# EAGLE design rev03 (EAGLE 6.5.0)
CrypTech avalanche noise evaluation board Revision 02 (c) NORDUnet A/S
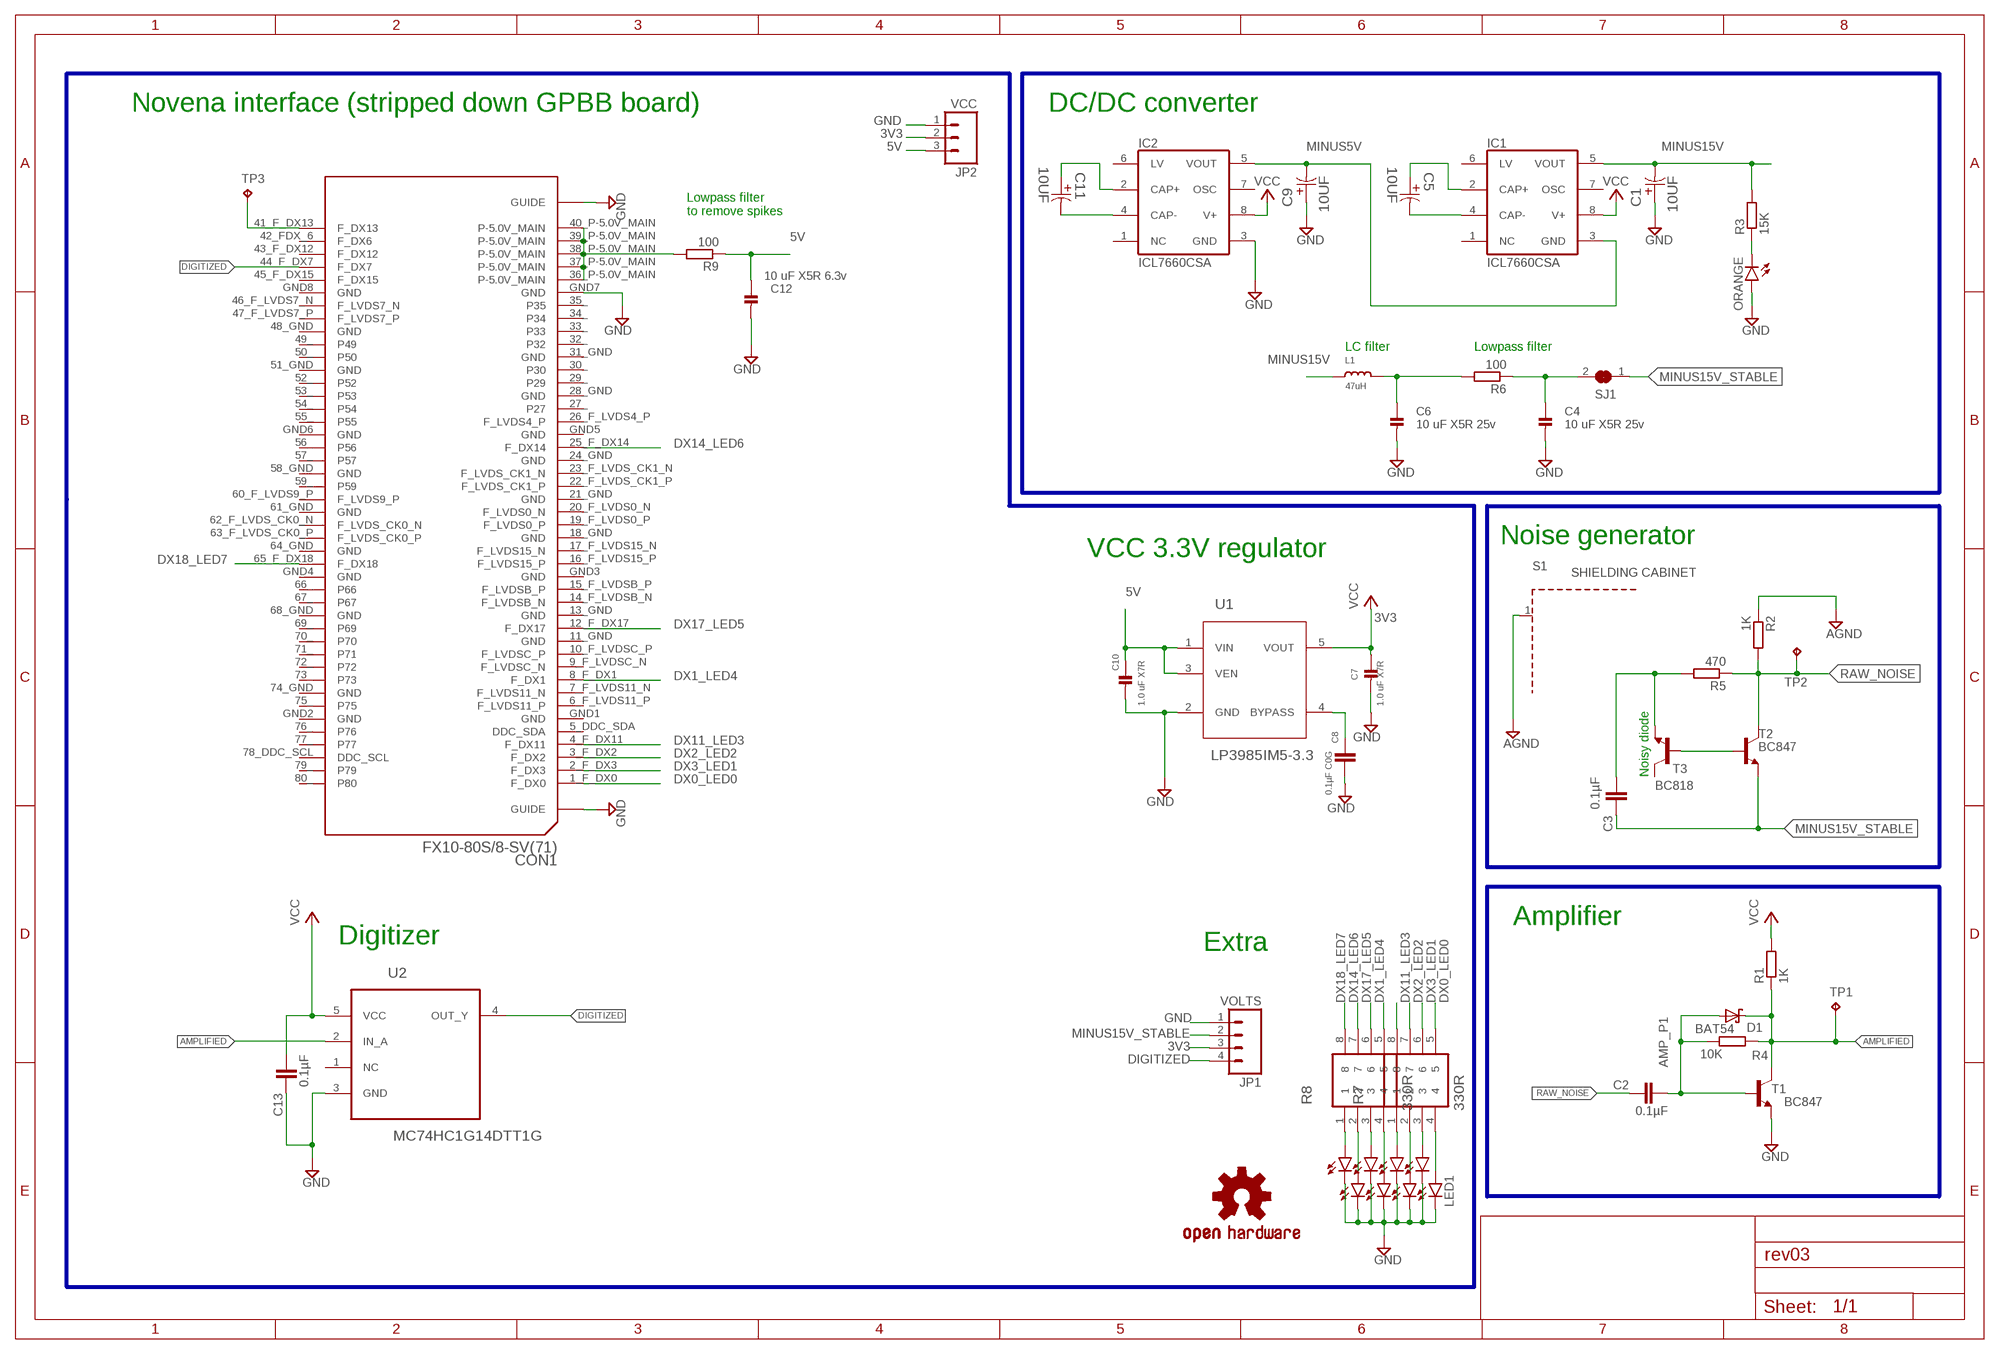
[diagram p0: schematic, sheet 1]

## Parts
C1  10UF  EEE-HA1E100R-CASE-C  [CAPAE530X610N]
C2  0.1µF  C-EUC0603  [C0603]
C3  0.1µF  C-EUC0603  [C0603]
C4  10 uF X5R 25v  CAP_CERAMIC_0805  [_0805]
C5  10UF  EEE-HA1E100R-CASE-C  [CAPAE530X610N]
C6  10 uF X5R 25v  CAP_CERAMIC_0805  [_0805]
C7  1.0 uF X7R  CAP_CERAMIC0805  [0805]
C8  0.1µF C0G  C-EUC0603  [C0603]
C9  10UF  EEE-HA1E100R-CASE-C  [CAPAE530X610N]
C10  1.0 uF X7R  CAP_CERAMIC0805  [0805]
C11  10UF  EEE-HA1E100R-CASE-C  [CAPAE530X610N]
C12  10 uF X5R 6.3v  CAP_CERAMIC0805  [0805]
C13  0.1µF  C-EUC0603  [C0603]
CON1  FX10-80S/8-SV(71)  [FX10A-80P/8-SV(71)]
D1  BAT54  [SOT23]
IC1  ICL7660CSA  [SO08]
IC2  ICL7660CSA  [SO08]
JP1  VOLTS  M04LOCK  [1X04_LOCK]
JP2  VCC  M03LOCK  [1X03_LOCK]
L1  47uH  INDUCTOR_0805  [_0805]
LED1  LED0603  [LED-0603]
LED2  LED0603  [LED-0603]
LED3  LED0603  [LED-0603]
LED4  LED0603  [LED-0603]
LED5  LED0603  [LED-0603]
LED6  LED0603  [LED-0603]
LED7  LED0603  [LED-0603]
LED8  LED0603  [LED-0603]
LOGO1  OSHW-LOGOL  [OSHW-LOGO-L]
ORANGE  LED0603  [LED-0603]
R1  1K  R-EU_R0603  [R0603]
R2  1K  R-EU_R0603  [R0603]
R3  15K  R-EU_R0603  [R0603]
R4  10K  R-EU_R0603  [R0603]
R5  470  R-EU_R0603  [R0603]
R6  100  R-EU_R0603  [R0603]
R7  330R  EXB38V331JV  [RESCAXE80P320X160X60-8N]
R8  330R  EXB38V331JV  [RESCAXE80P320X160X60-8N]
R9  100  R-EU_R0603  [R0603]
S1  SHIELDING CABINET  WE-SHC_36103205  [WE-SHC_36103205]
SJ1  SOLDERJUMPER_CLOSED  [SOLDERJUMPER_CLOSEDWIRE]
T1  BC847  [SOT23]
T2  BC847  [SOT23]
T3  BC818  BC818-40SMD  [SOT23-BEC]
TP1  TPB1,27  [B1,27]
TP2  TPB1,27  [B1,27]
TP3  TP_NEAT  [TP_NEAT_0032]
U1  LP3985IM5-3.3  [SOT95P300X120-5N]
U2  MC74HC1G14DTT1G  [SOT95P275X110-5N]

## Nets
3V3: C7.1 C13.2 JP1.3 JP2.2 R1.2 U1.5(VOUT) U2.5(VCC) ; supply symbol labelled VCC
5V: C10.1 C12.1 IC1.8(V+) IC2.8(V+) JP2.3 R9.1 U1.1(VIN) U1.3(VEN) ; supply symbol labelled VCC
AGND: C13.1 R2.1 S1.1(GND) T1.2(E) U2.3(GND) ; supply symbol labelled GND
AMP_P1: C2.2 D1.1(A) R4.1 T1.1(B)
AMPLIFIED: D1.3(C) R1.1 R4.2 T1.3(C) TP1.TP U2.2(IN_A)
DIGITIZED: CON1.44_F_DX7(F_DX7) JP1.4 U2.4(OUT_Y)
DX0_LED0: CON1.1_F_DX0(F_DX0) R7.5
DX1_LED4: CON1.8_F_DX1(F_DX1) R8.5
DX2_LED2: CON1.3_F_DX2(F_DX2) R7.7
DX3_LED1: CON1.2_F_DX3(F_DX3) R7.6
DX11_LED3: CON1.4_F_DX11(F_DX11) R7.8
DX13: CON1.41_F_DX13(F_DX13) TP3.TP
DX14_LED6: CON1.25_F_DX14(F_DX14) R8.7
DX17_LED5: CON1.12_F_DX17(F_DX17) R8.6
DX18_LED7: CON1.65_F_DX18(F_DX18) R8.8
GND [Ground]: C1.1 C4.2 C6.2 C7.2 C8.1 C9.1 C10.2 C12.2 CON1.GND7(GND) CON1.GUIDE@L(GUIDE) CON1.GUIDE@R(GUIDE) IC2.3(GND) JP1.1 JP2.1 LED1.C LED2.C LED3.C LED4.C LED5.C LED6.C LED7.C LED8.C ORANGE.A U1.2(GND)
MINUS5V: C9.2 IC1.3(GND) IC2.5(VOUT)
MINUS15V: C1.2 IC1.5(VOUT) L1.1 R3.2
MINUS15V_STABLE: C3.1 JP1.2 SJ1.1 T2.2(E)
N$1: C5.2 IC1.4(CAP-)
N$2: C11.2 IC2.4(CAP-)
N$3: C11.1 IC2.2(CAP+)
N$4: LED1.A R7.4
N$5: LED2.A R7.3
N$6: C4.1 R6.1 SJ1.2
N$7: ORANGE.C R3.1
N$8: C8.2 U1.4(BYPASS)
N$9: C5.1 IC1.2(CAP+)
N$11: C6.1 L1.2 R6.2
N$15: LED3.A R7.2
N$16: LED4.A R7.1
N$17: LED5.A R8.4
N$18: LED6.A R8.3
N$19: LED7.A R8.2
N$20: LED8.A R8.1
NOISE_IN: C3.2 R5.2 T3.E
NOISE_OUT: T2.1(B) T3.B
P-5.0V_MAIN: CON1.36_P-5.0V_MAIN(P-5.0V_MAIN) CON1.37_P-5.0V_MAIN(P-5.0V_MAIN) CON1.38_P-5.0V_MAIN(P-5.0V_MAIN) CON1.39_P-5.0V_MAIN(P-5.0V_MAIN) CON1.40_P-5.0V_MAIN(P-5.0V_MAIN) R9.2
RAW_NOISE: C2.1 R2.2 R5.1 T2.3(C) TP2.TP
Unconnected: CON1.5_DDC_SDA(DDC_SDA) CON1.6_F_LVDS11_P(F_LVDS11_P) CON1.7_F_LVDS11_N(F_LVDS11_N) CON1.9_F_LVDSC_N(F_LVDSC_N) CON1.10_F_LVDSC_P(F_LVDSC_P) CON1.11_GND(GND) CON1.13_GND(GND) CON1.14_F_LVDSB_N(F_LVDSB_N) CON1.15_F_LVDSB_P(F_LVDSB_P) CON1.16_F_LVDS15_P(F_LVDS15_P) CON1.17_F_LVDS15_N(F_LVDS15_N) CON1.18_GND(GND) CON1.19_F_LVDS0_P(F_LVDS0_P) CON1.20_F_LVDS0_N(F_LVDS0_N) CON1.21_GND(GND) CON1.22_F_LVDS_CK1_P(F_LVDS_CK1_P) CON1.23_F_LVDS_CK1_N(F_LVDS_CK1_N) CON1.24_GND(GND) CON1.26_F_LVDS4_P(F_LVDS4_P) CON1.27_(P27) CON1.28_GND(GND) CON1.29_(P29) CON1.30_(P30) CON1.31_GND(GND) CON1.32_(P32) CON1.33_(P33) CON1.34_(P34) CON1.35_(P35) CON1.42_FDX_6(F_DX6) CON1.43_F_DX12(F_DX12) CON1.45_F_DX15(F_DX15) CON1.46_F_LVDS7_N(F_LVDS7_N) CON1.47_F_LVDS7_P(F_LVDS7_P) CON1.48_GND(GND) CON1.49_(P49) CON1.50_(P50) CON1.51_GND(GND) CON1.52_(P52) CON1.53_(P53) CON1.54_(P54) CON1.55_(P55) CON1.56_(P56) CON1.57_(P57) CON1.58_GND(GND) CON1.59_(P59) CON1.60_F_LVDS9_P(F_LVDS9_P) CON1.61_GND(GND) CON1.62_F_LVDS_CK0_N(F_LVDS_CK0_N) CON1.63_F_LVDS_CK0_P(F_LVDS_CK0_P) CON1.64_GND(GND) CON1.66_(P66) CON1.67_(P67) CON1.68_GND(GND) CON1.69_(P69) CON1.70_(P70) CON1.71_(P71) CON1.72_(P72) CON1.73_(P73) CON1.74_GND(GND) CON1.75_(P75) CON1.76_(P76) CON1.77_(P77) CON1.78_DDC_SCL(DDC_SCL) CON1.79_(P79) CON1.80_(P80) IC1.1(NC) IC1.6(LV) IC1.7(OSC) IC2.1(NC) IC2.6(LV) IC2.7(OSC) T3.C U2.1(NC)

## Buses
B$1
B$2
B$3
B$4
B$5

## Notes on the sheet
- Novena interface (stripped down GPBB board) | DC/DC converter
- Lowpass filter
  to remove spikes
- LC filter | Lowpass filter
- Noise generator
- VCC 3.3V regulator
- Noisy diode
- Amplifier
- Digitizer | Extra

## Power pins joined to a net without a drawn wire
GND: CON1.GND1(GND) CON1.GND2(GND) CON1.GND3(GND) CON1.GND4(GND) CON1.GND5(GND) CON1.GND6(GND) CON1.GND8(GND)

## Library data of the parts
C1 C5 C9 C11 = Panasonic-EEEFT_EEEH:EEE-: Aluminum Electrolytic Capacitors,Surface Mount Type; MPN: EEE-HA1E100R; OC_FARNELL: 1973321; OC_NEWARK: 58T9232; PACKAGE: CASE-C; SUPPLIER: PANASONIC; TOLERANCE: ±20 %; VOLTAGERATING: 25V
C2 C3 C8 C13 = rcl:C-EU: CAPACITOR, European symbol
C4 C6 C7 C10 C12 = microbuilder:CAP_CERAMIC: Ceramic Capacitors 0402 - 0402 Surface Mount Capacitors 16pF 50V 5% [Digikey: 445-4899-2-ND] 18pF 50V 5% [Digikey: 490-1281-2-ND] 22pF 50V 5% [Digikey: 490-1283-2-ND] 68pF 50V 5% [Digikey: 490-1289-2-ND] 0.1uF 10V 10% [Digikey: 490-1318-2-ND] 1.0uF 6.3V 10% [Digikey: 490-1320-2-ND] 0603 - 0603 Surface Mount Capacitors 16 pF 50V 5% [Digikey: 445-5051-2-ND] 22 pF 50V [Digikey: PCC220ACVTR-ND] 33 pF 50V 5% [Digikey: 490-1415-1-ND] 56pF 50V 5% [Digikey: 490-1421-1-ND] 220pF 50V 5% [Digikey: 445-1285-1-ND] 680 pF 50V 2200 pF 50V 5% C0G [Digikey: 445-1297-1-ND] 5600 pF 100V 5% X7R [Digikey: 478-3711-1-ND] 0.1 µF 25V 10% [Digikey: PCC2277TR-ND] 0.22 µF 16V 10% X7R [Digikey: 445-1318-1-ND] 1.0 µF 25V 10% [Digikey: 445-5146-2-ND] 0603 - RF Specific 3pF 250V +/-0.1pF RF [Digikey: 712-1347-1-ND] 18 pF 250V 5% [Digikey: 478-3505-1-ND or 712-1322-1-ND] 56 pF 250V 5% C0G RF [Digikey: 490-4867-1-ND] 68 pF 250V RF [Digikey: 490-4868-1-ND] 0805 - 0805 Surface Mount Capacitors 220 pF 250V 2% RF Ceramic Capacitor [Digikey: 712-1398-1-ND] 1000 pF 50V 2% NP0 Ceramic Capacitor [Digikey: 478-3760-1-ND] 0.1 µF 25V 10% Ceramic Capacitor [Digikey: PCC1828TR-ND] 1.0 µF 16V 10% Ceramic Capacitor[Digikey: 490-1691-2-ND] 10.0 µF 10V 10% Ceramic Capacitor[Digikey: 709-1228-1-ND] 10.0 uF 16V 10% Ceramic Capacitor [Digikey: 478-5165-2-ND] 47 uF 6.3V 20% Ceramic Capacitor [Digikey: 587-1779-1-ND or 399-5506-1-ND] 1206 - 1206 Surface Mount Capacitors 47uF 10V 20% Ceramic Capacitor [Digikey: 490-5528-1-ND or 399-5508-1-ND or 445-6010-1-ND] 100uF 6.3V -20%, +80% Y5V Ceramic Capacitor (Digikey: 490-4512-1-ND, Mouser: 81-GRM31CF50J107ZE1L)
CON1 = Novena_FX10A-80S:FX10*-80S/8-SV(71): HRS FX10A-80S/8-SV(71) 10+ Gbps 0.5 mm pitch Stacking Connectors This is the connector used to connect the General Purpose Breakout Board (GPBB) to the Novena.
D1 = diode:BAT54: Schottky Diodes Source: Fairchild .. BAT54.pdf
IC1 IC2 = maxim:ICL7660CSA: VOLTAGE CONVERTER; MF: MAXIM; MPN: ICL7660CSA; OC_FARNELL: 9724710; OC_NEWARK: 34C3732
JP1 = SparkFun-Connectors:M04: Header 4 Standard 4-pin 0.1" header. Use with straight break away headers (SKU : PRT-00116), right angle break away headers (PRT-00553), swiss pins (PRT-00743), machine pins (PRT-00117), and female headers (PRT-00115). Molex polarized connector foot print use with SKU : PRT-08231 with associated crimp pins and housings. 1MM SMD Version SKU: PRT-10208
JP2 = SparkFun-Connectors:M03: Header 3 Standard 3-pin 0.1" header. Use with straight break away headers (SKU : PRT-00116), right angle break away headers (PRT-00553), swiss pins (PRT-00743), machine pins (PRT-00117), and female headers (PRT-00115). Molex polarized connector foot print use with SKU : PRT-08232 with associated crimp pins and housings.
L1 = microbuilder:INDUCTOR: Inductors 0603: 10nH Ceramic Inductor - microwire antenna/RF (Digikey: 712-1434-2-ND) 0805: 560nH Ceramic Inductor - RF (Digikey: 553-1047-1-ND) 270nH Ceramic Inductor - Q = 40@250MHz, +-5%, 1 Ohm DC Resistance (Digikey: 535-10506-2-ND) 1007 (2518 Metric) SMT: 10µH 10% 250mOhm 820mA 1007 Inductor (Digikey: 587-2189-1-ND) 22µH 10% 500mOhm 580mA 1007 Inductor (Digikey: 587-2190-1-ND) 47µH 10% 950mOhm 420mA 1007 Inductor (Digikey: 587-2191-1-ND) 47µH 5% 100mOhm 1A 1008 Inductor (Digikey: 732-1816-1-ND) 5.0x5.0mm (Taiyo Yuden NR5040 Series) 6.8µH 20% 2.3A 64mOhm Inductor (Digikey: 587-2374-2-ND) 5.0x5.0mm (TDK VLC5045 Series) 4.7µH 20% 3.3A 34mOhm Inductor (Digikey: 445-6526-1-ND) 6.8µH 20% 2.7A 46mOhm Inductor (Digikey: 445-6527-1-ND) 6.0x6.0mm (TDK VLC6045 Series) 4.7µH 20% 3.8A 27mOhm Inductor (Digikey: 445-6538-2-ND) 6.8µH 20% 3A 41mOhm Inductor (Digikey: 445-6540-1-ND) 6.2µH 30% 2.2A 45mOhm Inductor (Digikey: SRR5028-6R2YCT-ND) - Not TDK VLC6045 but footprint should match 6.0x6.0mm (TDK SLF6045 Series) 6.8uH 30% 2A 33mOhm Inductor (Digikey: 445-4572-1-ND, Mouser: 810-SLF645T6R8N2R0PF)
LED1-LED8 ORANGE = SparkFun-LED:LED: LEDs Standard schematic elements and footprints for 5mm, 3mm, 1206, and 0603 sized LEDs. 5mm - Spark Fun Electronics SKU : COM-00529 (and others)
LOGO1 = SparkFun-Aesthetics:OSHW-LOGO: Open Source Hardware Logo This logo indicates the piece of hardware it is found on incorporates a OSHW license and/or adheres to the definition of open source hardware found here: http://freedomdefined.org/OSHW
R1-R6 R9 = resistor:R-EU_: RESISTOR, European symbol
R7 R8 = Panasonic-EXB-ERJ:EXB38V: Chip Resistor Array; MPN: EXB38V331JV; OC_FARNELL: 2060095; OC_NEWARK: 65T9098; PACKAGE: 0603; POWERRATING: 0.063 W/element; SUPPLIER: PANASONIC; TOLERANCE: ±5 %
S1 = WE-SHC:WE-SHC: WE-SHC Shielding cabinet; MPN: 36103205; OC_FARNELL: 1909657; OC_NEWARK: 58T2480; PACKAGE: Frame_SMD; SUPPLIER: Wuerth Elektronik
SJ1 = microbuilder:SOLDERJUMPER_CLOSED: Solder Jumper - Closed These solder jumpers are closed by default CLOSEDWIRE - 10 mil trace between pads that can be cut and resoldered later CLOSEDPERM - 63 mil trace between pads for a permanent connection (used to 'bridge' two signals, a shameless hack for Eagle). Can double as a test point as well (no cream layer)
T1 T2 = transistor:BC847: NPN TRANSISTOR
T3 = transistor-npn:BC818*: NPN Transistor
TP1 TP2 = testpad:TP: Test pad
TP3 = BetterTestpads:TP_NEAT: Throughhole testpoint with neat footprint
U1 = LP3985IM5:LP3985IM5-3.3: Low-Dropout CMOS Voltage Regulator; MPN: LP3985IM5-3.3; OC_FARNELL: 1469025; OC_NEWARK: 23K8224; PACKAGE: SOT-5; SUPPLIER: NationalSemiconductor
U2 = MC74HC1G14DTT1G:MC74HC1G14DTT1G: Single Inverter with Schmitt-Trigger Input; MPN: MC74HC1G14DTT1G; OC_FARNELL: 1468757; OC_NEWARK: 71J5593; PACKAGE: SOT-23-5; SUPPLIER: ON SEMICONDUCTOR

## Net classes
1 Ground: width 0.203 mm, drill 0.61 mm

## Board
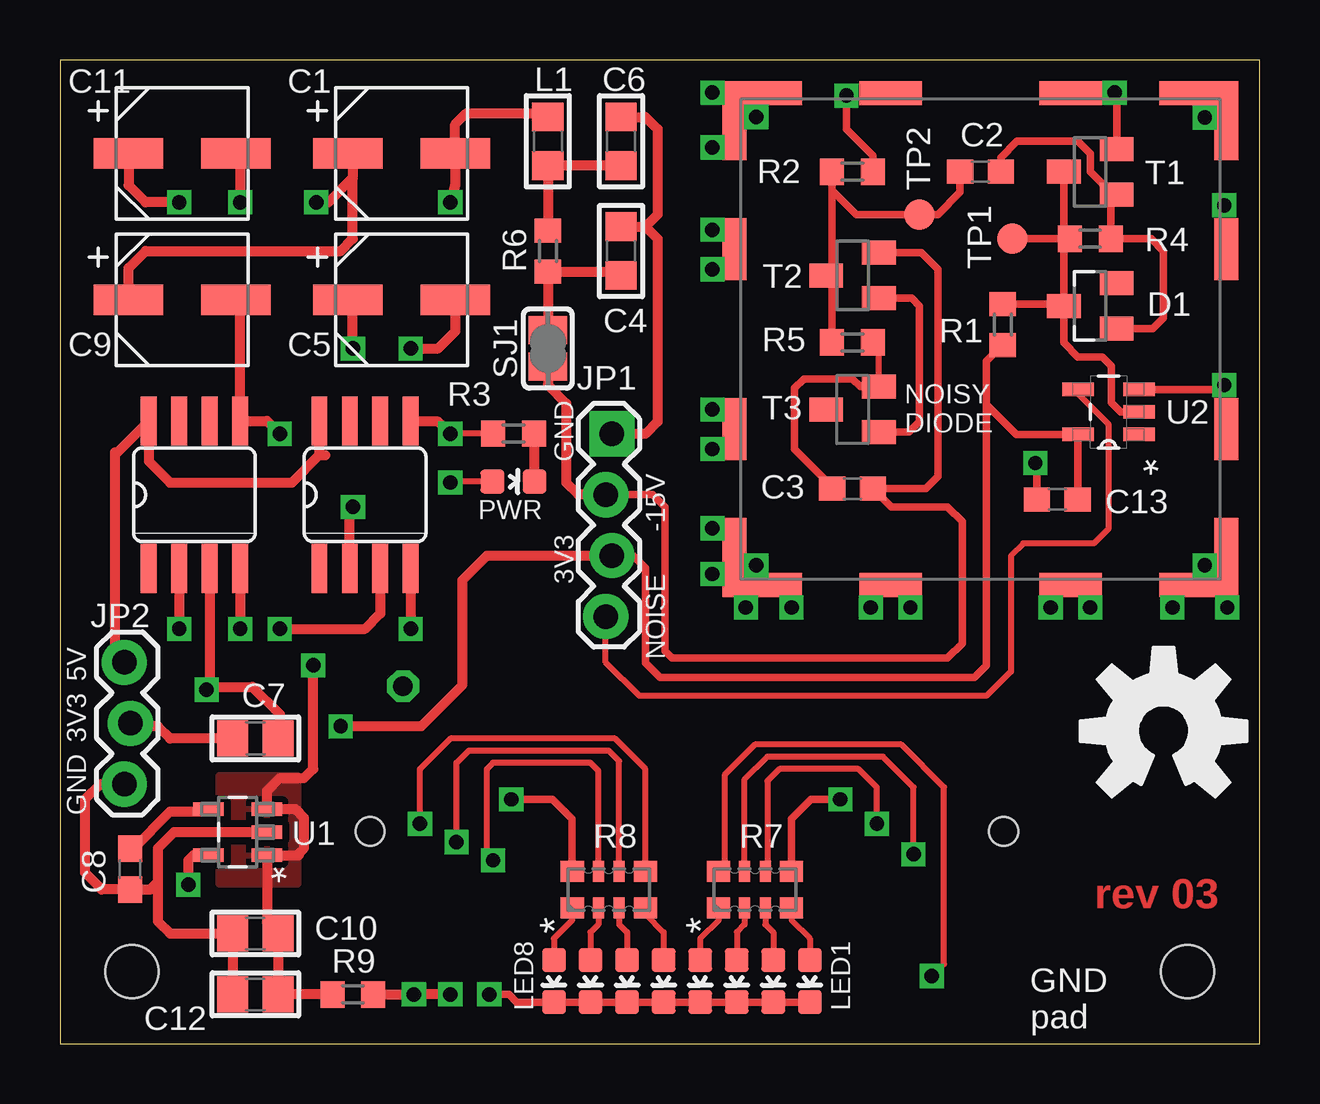
[diagram p1: board, top side]
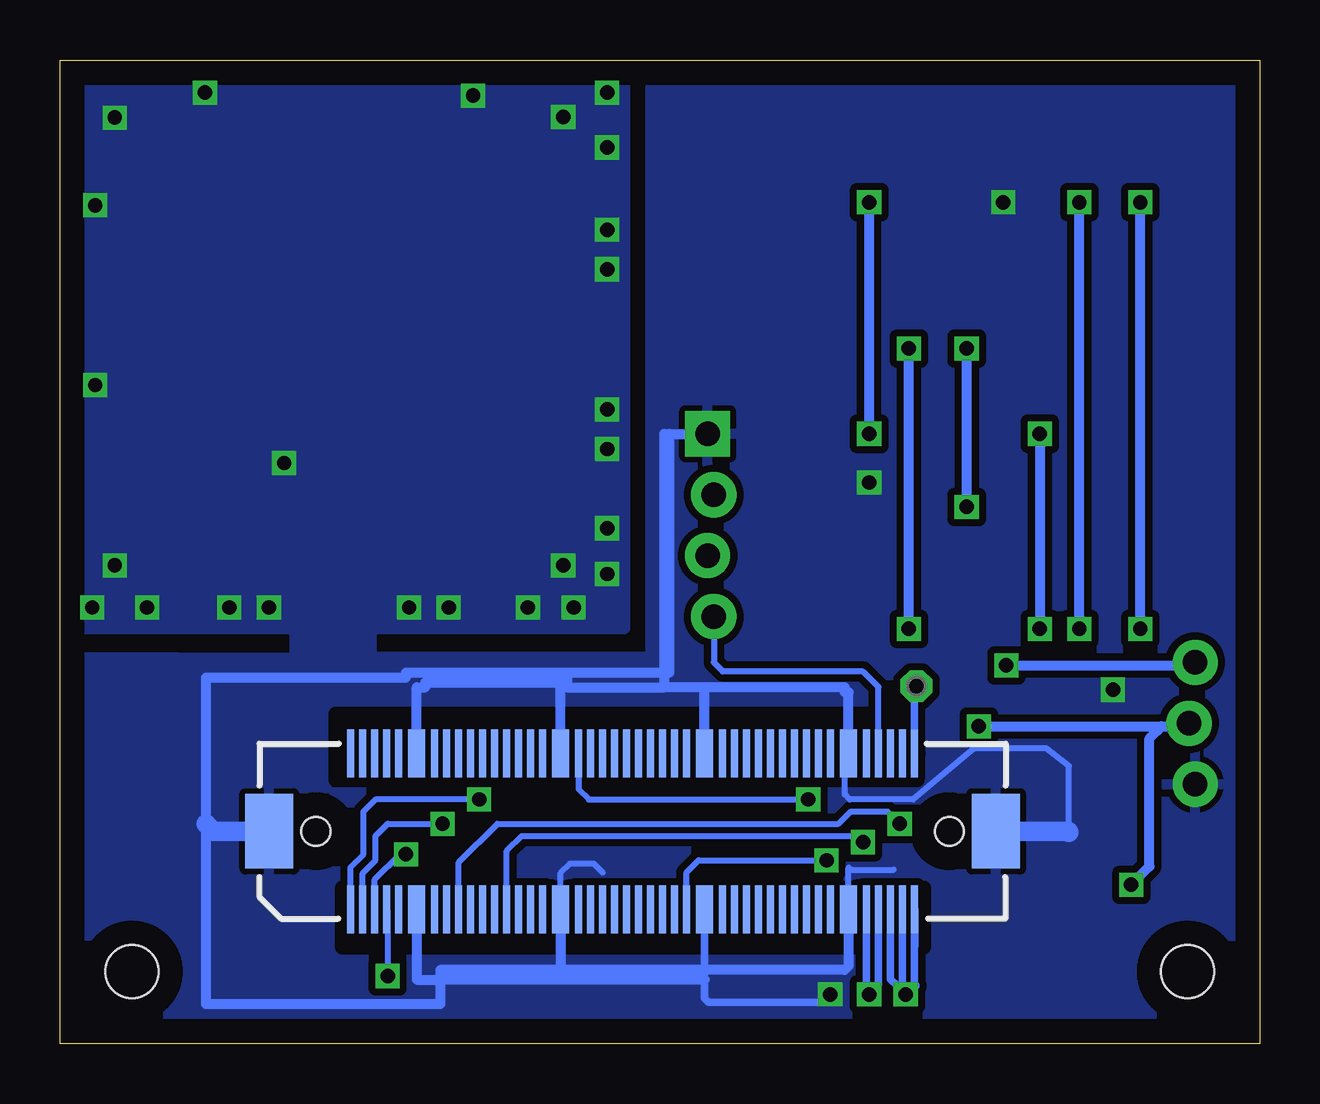
[diagram p2: board, bottom side, seen from below]

Size 50 x 41 mm. Coordinates in mm from the lower left corner, seen from the top.
Outline: 50,0 50,41 0,41 0,0 50,0
Copper layers (1*16): Top 0.035mm / dielectric 1.5mm / Bottom 0.035mm
Design rules "cogra": minimum track width 10mil, minimum drill 0.3mm, track to track 8mil, track to pad 8mil, pad to pad 8mil, via to via 8mil, smd to smd 8mil, copper to edge 40mil, drill to drill 8mil, minimum pad ring 10mil, minimum via ring 8mil, stop-mask expansion 4mil, vias tented up to drill 0mil, thermal gap 10mil
Holes 2.2 mm at 3,3 47,3
bRestrict: area 14.3,11 to 38.5,13.7; area 14,4 to 38.2,6.5

### Footprints (pad centres in the part's own frame; a part is rotated, then mirrored left to right if it is on the bottom)
CAPAE530X610N = smd 2.896 x 1.27: 1 -2.235,0; 2 2.235,0
C0603 = smd 1.1 x 1: 1 -0.85,0; 2 0.85,0
_0805 = smd 1.2 x 1.3: 1 -1.016,0; 2 1.016,0
0805 = smd 1.3 x 1.5: 1 -0.95,0; 2 0.95,0
FX10A-80P/8-SV(71) = smd 0.3 x 2 bottom: 1_F_DX0 11.48,-3.25; 2_F_DX3 10.98,-3.25; 3_F_DX2 10.48,-3.25; 4_F_DX11 9.98,-3.25; 5_DDC_SDA 9.48,-3.25; 6_F_LVDS11_P 7.98,-3.25; 7_F_LVDS11_N 7.48,-3.25; 8_F_DX1 6.98,-3.25; 9_F_LVDSC_N 6.48,-3.25; 10_F_LVDSC_P 5.98,-3.25; 11_GND 5.48,-3.25; 12_F_DX17 4.98,-3.25; 13_GND 4.48,-3.25; 14_F_LVDSB_N 3.98,-3.25; 15_F_LVDSB_P 3.48,-3.25; 16_F_LVDS15_P 1.98,-3.25; 17_F_LVDS15_N 1.48,-3.25; 18_GND 0.98,-3.25; 19_F_LVDS0_P 0.48,-3.25; 20_F_LVDS0_N -0.02,-3.25; 21_GND -0.52,-3.25; 22_F_LVDS_CK1_P -1.02,-3.25; 23_F_LVDS_CK1_N -1.52,-3.25; 24_GND -2.02,-3.25; 25_F_DX14 -2.52,-3.25; 26_F_LVDS4_P -4.02,-3.25; 27_ -4.52,-3.25; 28_GND -5.02,-3.25; 29_ -5.52,-3.25; 30_ -6.02,-3.25; 31_GND -6.52,-3.25; 32_ -7.02,-3.25; 33_ -7.52,-3.25; 34_ -8.02,-3.25; 35_ -8.52,-3.25; 36_P-5.0V_MAIN -10.02,-3.25; 37_P-5.0V_MAIN -10.52,-3.25; 38_P-5.0V_MAIN -11.02,-3.25; 39_P-5.0V_MAIN -11.52,-3.25; 40_P-5.0V_MAIN -12.02,-3.25; 41_F_DX13 -12.02,3.25; 42_FDX_6 -11.52,3.25; 43_F_DX12 -11.02,3.25; 44_F_DX7 -10.52,3.25; 45_F_DX15 -10.02,3.25; 46_F_LVDS7_N -8.52,3.25; 47_F_LVDS7_P -8.02,3.25; 48_GND -7.52,3.25; 49_ -7.02,3.25; 50_ -6.52,3.25; 51_GND -6.02,3.25; 52_ -5.52,3.25; 53_ -5.02,3.25; 54_ -4.52,3.25; 55_ -4.02,3.25; 56_ -2.52,3.25; 57_ -2.02,3.25; 58_GND -1.52,3.25; 59_ -1.02,3.25; 60_F_LVDS9_P -0.52,3.25; 61_GND -0.02,3.25; 62_F_LVDS_CK0_N 0.48,3.25; 63_F_LVDS_CK0_P 0.98,3.25; 64_GND 1.48,3.25; 65_F_DX18 1.98,3.25; 66_ 3.48,3.25; 67_ 3.98,3.25; 68_GND 4.48,3.25; 69_ 4.98,3.25; 70_ 5.48,3.25; 71_ 5.98,3.25; 72_ 6.48,3.25; 73_ 6.98,3.25; 74_GND 7.48,3.25; 75_ 7.98,3.25; 76_ 9.48,3.25; 77_ 9.98,3.25; 78_DDC_SCL 10.48,3.25; 79_ 10.98,3.25; 80_ 11.48,3.25 | smd 0.7 x 2 bottom: GND1 8.73,-3.25; GND2 2.73,-3.25; GND3 -3.27,-3.25; GND4 -9.27,-3.25; GND5 -9.27,3.25; GND6 -3.27,3.25; GND7 2.73,3.25; GND8 8.73,3.25 | smd 2 x 3.1 bottom: GUIDE@L 14.88,0; GUIDE@R -15.42,0 | hole 1.2: -13.47,0; 12.93,0
SOT23 = smd 1 x 1.4: 1 -0.95,-1.1; 2 0.95,-1.1; 3 0,1.1
SO08 = smd 0.66 x 2.032: 1 -1.905,-3.073; 2 -0.635,-3.073; 3 0.635,-3.073; 4 1.905,-3.073; 5 1.905,3.073; 6 0.635,3.073; 7 -0.635,3.073; 8 -1.905,3.073
1X04_LOCK = drill 1.016 pad 1.88 square: 1 0,0.127 | drill 1.016 pad 1.88: 2 2.54,-0.127; 3 5.08,0.127; 4 7.62,-0.127
1X03_LOCK = drill 1.016 pad 1.88: 1 0,0.127; 2 2.54,-0.127; 3 5.08,0.127
LED-0603 = smd 1 x 1: A 0,-0.877; C 0,0.877
R0603 = smd 1 x 1.1: 1 -0.85,0; 2 0.85,0
RESCAXE80P320X160X60-8N = smd 0.864 x 0.965: 1 -0.762,1.524; 4 -0.762,-1.524; 5 0.762,-1.524; 8 0.762,1.524 | smd 0.864 x 0.457: 2 -0.762,0.432; 3 -0.762,-0.432; 6 0.762,-0.432; 7 0.762,0.432
WE-SHC_36103205 = smd 3.3 x 1: 1 9.1,10.25; 6 9.1,-10.25; 9 -9.1,-10.25; 14 -9.1,10.25 | smd 1 x 3.3: 2 10.25,9.1; 5 10.25,-9.1; 10 -10.25,-9.1; 13 -10.25,9.1 | smd 1 x 2.6: 3 10.25,3.75; 4 10.25,-3.75; 11 -10.25,-3.75; 12 -10.25,3.75 | smd 2.6 x 1: 7 3.75,-10.25; 8 -3.75,-10.25; 15 -3.75,10.25; 16 3.75,10.25
SOLDERJUMPER_CLOSEDWIRE = smd 1.168 x 1.6: 1 -0.762,0; 2 0.762,0 | smd 0.61 x 0.305: WIRE 0,0
SOT23-BEC = smd 1 x 1.4: B -0.95,-1.1; C 0,1.1; E 0.95,-1.1
B1,27 = smd 1.27 x 1.27: TP 0,0
TP_NEAT_0032 = drill 0.813 octagon: TP -0.01,-0.001
SOT95P300X120-5N = smd 1.27 x 0.559: 1 -1.219,0.965; 2 -1.219,0; 3 -1.219,-0.965; 4 1.219,-0.965; 5 1.219,0.965
SOT95P275X110-5N = smd 1.321 x 0.559: 1 -1.27,0.94; 2 -1.27,0; 3 -1.27,-0.94; 4 1.27,-0.94; 5 1.27,0.94

### Placement (x,y rotation side)
C1  14.24,37.1 0 top
C2  38.37,36.34 0 top
C3  33.04,23.13 180 top
C4  23.38,33.04 90 top
C5  14.24,31 0 top
C6  23.38,37.61 90 top
C7  8.14,12.72 0 top
C8  2.92,7.27 90 top
C9  5.1,31 0 top
C10  8.14,4.59 180 top
C11  5.1,37.1 0 top
C12  8.14,2.05 180 top
C13  41.57,22.67 0 top
CON1  26.4,8.85 0 top
D1  42.94,30.75 90 top
IC1  12.72,22.88 0 top
IC2  5.6,22.88 0 top
JP1  22.88,25.42 270 top
JP2  2.81,10.81 90 top
L1  20.34,37.61 270 top
LED1  31.26,2.6 180 top
LED2  29.73,2.6 180 top
LED3  28.21,2.6 180 top
LED4  26.69,2.6 180 top
LED5  25.16,2.6 180 top
LED6  23.64,2.6 180 top
LED7  22.11,2.6 180 top
LED8  20.59,2.6 180 top
LOGO1  46,13.03 0 top
ORANGE  18.9,23.43 270 top
R1  39.3,29.97 270 top
R2  33.04,36.34 180 top
R3  18.9,25.43 180 top
R4  42.94,33.54 180 top
R5  33.04,29.23 0 top
R6  20.34,33.04 90 top
R7  28.97,6.41 90 top
R8  22.88,6.41 90 top
R9  12.21,2.05 0 top
S1  38.37,29.36 0 top
SJ1  20.34,28.97 90 top
T1  42.94,36.34 90 top
T2  33.04,32.02 90 top
T3  33.04,26.43 90 top
TP1  39.69,33.54 90 top
TP2  35.83,34.56 90 top
TP3  14.29,14.9 0 bottom
U1  7.41,8.81 180 top
U2  43.7,26.33 180 top

### Tracks (layer width: path | path; a pad name or v marks a point on that pad's centre or on a via)
3V3  (via drill 0.6)
  Top 0.305: JP1.3 23.89,20.34 24.4,19.83 24.4,15.87 25.01,15.26 38.12,15.26 38.62,15.76 38.62,26.64 | R1.2 38.62,28.45 38.62,26.64 | 38.62,26.64 39.87,25.39 U2.5 42.43,23.5 C13.2
  Top 0.406: U1.5 5.56,7.85 5.35,7.64 v5.35,6.62 | C7.1 4.59,12.72 4.08,13.22 3.06,13.22 JP2.2 | JP1.3 17.8,20.34 16.78,19.32 16.78,14.95 15.05,13.22 v11.7,13.22
  Bottom 0.406: v5.35,6.62 4.59,7.38 4.59,12.72 4.08,13.22 | 4.08,13.22 3.06,13.22 JP2.2 | v11.7,13.22 4.08,13.22
5V  (via drill 0.6)
  Top 0.406: 10.81,24.53 9.67,23.38 4.59,23.38 3.7,24.27 IC2.8 2.4,24.65 2.3,24.65 2.3,16.27 JP2.3 | IC1.8 10.81,24.53 | R9.1 C12.1 C10.1 8.63,5.05 U1.1 9.88,7.85 | 9.88,7.85 10.18,8.14 10.18,9.41 9.81,9.78 U1.3 8.63,10.53 9.16,11.06 10.18,11.06 10.56,11.45 v10.56,15.76 | 10.81,24.53 11.06,24.53 | 9.88,7.85 9.96,7.85
  Bottom 0.406: v10.56,15.76 2.81,15.76 JP2.3
  pour Top (isolate 0.305): 6.62,11.19 9.92,11.19 9.92,6.62 6.62,6.62
AGND  (via drill 0.6)
  Top 0.305: T1.2 44.04,39.56 v43.96,39.64 | R2.1 33.89,37.01 32.78,38.12 v32.78,39.51 | U2.3 48.35,27.27 v48.53,27.45 | C13.1 40.72,24.13
  Top 0.406: 40.72,24.13 v40.66,24.2 | 47.56,39.52 S1.1 47.72,39.61 v47.72,38.6
  other vias: 27.19,39.64 27.19,37.35 27.19,33.92 27.19,32.27 27.19,26.43 27.19,24.78 27.19,21.48 27.19,19.57 28.59,18.18 30.5,18.18 33.8,18.18 35.45,18.18 41.29,18.18 42.94,18.18 46.37,18.18 48.66,18.18 48.53,34.94 29.02,38.62 29.02,19.93 47.72,19.93
  pour Bottom: 49.8,40.91 49.8,17.29 26.43,17.29 26.43,40.91
AMP_P1
  Top 0.305: D1.1 45.55,29.8 45.99,30.24 45.99,33.04 45.48,33.54 R4.1 43.79,35.14 T1.1 43.89,35.39 42.94,36.34 42.94,37.1 42.43,37.61 39.89,37.61 39.22,36.93 C2.2
AMPLIFIED
  Top 0.305: T1.3 41.84,33.79 R4.2 | D1.3 41.84,33.29 R4.2 | D1.3 41.77,30.82 R1.1 | D1.3 41.84,29.21 42.43,28.62 43.45,28.62 43.83,28.23 43.83,26.71 44.21,26.33 U2.2 | 39.61,33.54 TP1.TP R4.2
DIGITIZED
  Top 0.254: JP1.4 22.75,15.89 24.15,14.49 38.62,14.49 39.64,15.51 39.64,20.34 40.15,20.84 43.09,20.84 43.7,21.45 43.7,25.82 42.43,27.09 U2.4
  Bottom 0.254: CON1.44_F_DX7 15.88,14.86 16.53,15.51 22.37,15.51 22.75,15.89 JP1.4
DX0_LED0  (via drill 0.6)
  Top 0.305: v32.53,10.18 31.31,10.18 30.5,9.36 R7.5
  Bottom 0.254: v32.53,10.18 36.85,10.18 37.35,9.67 37.35,7.89 37.88,7.36 CON1.1_F_DX0
DX1_LED4  (via drill 0.6)
  Top 0.254: v15,9.16 15,11.45 16.27,12.72 23.13,12.72 24.4,11.45 R8.5
  Bottom 0.254: CON1.8_F_DX1 33.38,7.55 31.77,9.16 17.54,9.16 17.03,9.67 15.51,9.67 v15,9.16
DX2_LED2  (via drill 0.6)
  Top 0.254: v35.58,7.89 35.58,10.68 34.31,11.95 29.48,11.95 28.54,11.01 R7.7
  Bottom 0.254: CON1.3_F_DX2 36.88,6.84 35.83,7.89
  Bottom 0.305: 35.83,7.89 v35.58,7.89
DX3_LED1  (via drill 0.6)
  Top 0.254: v34.05,9.16 34.05,10.68 33.29,11.45 29.99,11.45 29.48,10.94 29.48,7.25 R7.6
  Bottom 0.254: CON1.2_F_DX3 37.38,7.1 36.85,7.64 36.85,8.65 36.34,9.16 v34.05,9.16
DX11_LED3  (via drill 0.6)
  Top 0.254: R7.8 27.7,7.43 27.7,11.19 28.97,12.46 35.07,12.46 36.85,10.68 36.85,3.32 v36.34,2.81
  Bottom 0.254: CON1.4_F_DX11 36.34,5.51 v36.34,2.81
DX13
  Bottom 0.305: CON1.41_F_DX13 14.38,14.81 TP3.TP
DX14_LED6  (via drill 0.6)
  Top 0.254: v18.05,7.64 17.8,7.89 17.8,11.45 18.05,11.7 22.11,11.7 22.44,11.37 R8.7
  Bottom 0.254: CON1.25_F_DX14 23.88,7.14 23.38,7.64 v18.05,7.64
DX17_LED5  (via drill 0.6)
  Top 0.254: v16.53,8.4 16.53,11.7 17.03,12.21 22.88,12.21 23.31,11.78 R8.6
  Bottom 0.254: CON1.12_F_DX17 31.38,8.02 30.75,8.65 16.27,8.65 v16.53,8.4
DX18_LED7  (via drill 0.6)
  Top 0.305: v18.81,10.18 20.54,10.18 21.35,9.36 R8.8
  Bottom 0.254: CON1.65_F_DX18 28.38,10.6 27.96,10.18 v18.81,10.18
GND  (via drill 0.6)
  Top 0.254: LED3.C 28.21,1.59 | 26.82,1.59 LED4.C | LED8.C LED7.C 23.52,1.73 LED6.C | LED3.C LED4.C | LED2.C LED3.C | LED5.C LED4.C | ORANGE.A 16.32,23.43 v16.27,23.38
  Top 0.305: LED2.C LED1.C | LED1.C 31.37,1.73 | LED1.C LED5.C LED6.C | 23.52,1.73 19.03,1.73 18.71,2.05 v17.9,2.05
  Top 0.406: C9.1 2.86,32.33 3.57,33.04 11.7,33.04 12.21,33.54 12.21,36.08 | C1.1 12.21,36.9 12.21,36.08 | 12.21,36.08 11.19,35.07 v10.68,35.07 | C6.2 24.4,38.62 24.91,38.12 24.91,34.56 24.4,34.05 | C4.2 24.4,34.05 | 24.4,34.05 24.91,33.54 24.91,25.92 24.4,25.42 JP1.1 | JP2.1 1.67,10.81 1.03,10.18 1.03,7.13 1.74,6.42 C8.1 3.77,6.42 4.08,6.73 | U1.2 4.75,8.81 4.08,8.14 4.08,6.73 | IC2.3 6.24,14.88 | 6.24,14.88 v6.11,14.75 | 6.24,14.88 8.02,14.88 9.16,13.73 9.16,12.78 C7.2 | C12.2 C10.2 4.59,4.59 4.08,5.1 4.08,6.73
  Bottom 0.254: CON1.GND4 17.13,7.32 17,7.25 15.25,7.25 | CON1.GND2 29.13,7.12 28.75,7.5 27.75,7.5 27.38,7.13 | 17.03,5.6 17.11,5.68 17.29,5.86 | 7.94,8.81 7.94,11.56 8.89,12.31 11.9,12.31 14.44,10.18 17.09,10.18 17.29,10.38 17.29,11.94 CON1.GND5
  Bottom 0.305: CON1.GND3 23.13,1.88 22.98,1.73 18.22,1.73 v17.9,2.05
  Bottom 0.406: 17.11,5.68 17.13,5.68 CON1.GND4 17.13,3.22 17.29,3.06 34.15,3.06 34.15,2.66 | CON1.GND5 17.13,14.65 17.29,14.65 17.29,14.85 23.13,14.85 | 23.13,14.85 24.81,14.85 | 24.81,14.85 24.81,25.42 24.6,25.42 | CON1.GND6 23.13,14.85 | CON1.GND7 29.13,15.05 | 29.13,15.05 29.13,15.26 28.87,15.26 28.87,14.85 24.81,14.85 | CON1.GND8 35.13,14.85 34.76,14.85 34.76,15.05 29.13,15.05 | 34.15,2.66 34.15,1.64 43.91,1.64 43.91,9.16 43.91,15.26 35.58,15.26 35.58,15.46 24.6,15.46 24.6,25.42 | 22.98,25.42 JP1.1 24.6,25.42 | 22.98,25.42 22.98,25.21 23.18,25.21 23.18,25.62 22.77,25.62 22.77,25.42 22.98,25.42 | CON1.GND1 35.13,2.66 34.15,2.66 | CON1.GND2 29.13,2.66 | 29.13,2.66 34.15,2.66 | 23.13,2.66 29.13,2.66
  Bottom 0.813: CON1.GUIDE@L 43.59,8.85 43.91,9.16 | CON1.GUIDE@R 7.98,8.85 7.94,8.81
  pour Bottom (isolate 0.305): 25.42,16.11 37,16.11 37,17.49 40.25,17.49 40.25,16.07 49.8,16.11 49.8,16.07 50,0.01 0,0.01 0,41 25.42,40.91
MINUS5V  (via drill 0.6)
  Top 0.406: C9.2 7.51,30.83 IC2.5 8.63,25.95 v9.16,25.42 | IC1.3 13.35,17.92 12.72,17.29 v9.16,17.29
  Bottom 0.406: v9.16,25.42 v9.16,17.29
MINUS15V  (via drill 0.6)
  Top 0.254: R3.2 16.28,25.43 v16.27,25.42
  Top 0.406: v16.27,35.07 16.48,35.78 C1.2 16.48,38.32 16.93,38.78 20.18,38.78 L1.1 | v16.27,25.42 15.76,25.92 14.65,25.92 IC1.5
  Bottom 0.406: v16.27,35.07 v16.27,25.42
MINUS15V_STABLE
  Top 0.305: JP1.2 24.7,22.88 25.21,22.37 25.21,16.37 25.52,16.07 37,16.07 37.61,16.68 37.61,21.76 37,22.37 34.65,22.37 C3.1 36.08,23.13 36.59,23.64 36.59,32.27 35.9,32.97 T2.2
  Top 0.406: SJ1.1 20.34,27.45 21.1,26.69 21.1,23.38 21.61,22.88 JP1.2
N$1  (via drill 0.6)
  Top 0.406: IC1.4 v14.62,17.29 | v14.62,28.97 15.76,28.97 16.48,29.68 C5.2
  Bottom 0.406: v14.62,17.29 v14.62,28.97
N$2  (via drill 0.6)
  Top 0.406: IC2.4 v7.51,17.29 | C11.2 7.64,37.1 7.51,36.97 v7.51,35.07 7.64,35.2
  Bottom 0.406: v7.51,17.29 v7.51,35.07
N$3  (via drill 0.6)
  Top 0.406: IC2.2 v4.97,17.29 | v4.97,35.07 3.57,35.07 2.86,35.78 C11.1
  Bottom 0.406: v4.97,17.29 v4.97,35.07
N$4
  Top 0.254: R7.4 30.5,5.14 31.26,4.38 LED1.A
N$5
  Top 0.254: R7.3 29.4,4.97 29.73,4.64 LED2.A
N$6
  Top 0.406: SJ1.2 R6.1 23.22,32.19 C4.1
N$7
  Top 0.406: R3.1 19.75,23.45 ORANGE.C
N$8
  Top 0.406: C8.2 3.04,8.12 4.59,9.67 6.08,9.67 U1.4
N$9  (via drill 0.6)
  Top 0.406: IC1.2 12.08,22.24 v12.21,22.37 | v12.21,28.97 12.21,30.8 C5.1
  Bottom 0.406: v12.21,22.37 v12.21,28.97
N$11
  Top 0.406: 20.34,36.8 L1.2 | L1.2 R6.2 | C6.1 L1.2
N$15
  Top 0.254: R7.2 28.54,4.97 28.21,4.64 LED3.A
N$16
  Top 0.254: R7.1 27.45,5.14 26.69,4.38 LED4.A
N$17
  Top 0.254: R8.4 24.4,5.4 25.16,4.64 LED5.A
N$18
  Top 0.254: R8.3 23.31,4.97 23.64,4.64 LED6.A
N$19
  Top 0.254: R8.2 22.44,4.97 22.11,4.64 LED7.A
N$20
  Top 0.254: R8.1 21.35,5.14 20.59,4.38 LED8.A
NOISE_IN
  Top 0.254: T3.E 34.14,28.98 R5.2
  Top 0.305: 33.99,27.38 T3.E 33.36,27.38 33.04,27.7 31,27.7 30.62,27.32 30.62,24.78 32.19,23.22 C3.2
NOISE_OUT
  Top 0.305: T2.1 35.51,31.07 35.83,30.75 35.83,25.92 35.39,25.48 T3.B
P-5.0V_MAIN  (via drill 0.6)
  Top 0.406: R9.2 v14.75,2.05 v16.27,2.05
  Bottom 0.305: 14.37,4.08 14.37,5.58 CON1.40_P-5.0V_MAIN 14.38,2.42 | v14.75,2.05 15.1,2.4 15.38,2.68 CON1.38_P-5.0V_MAIN | CON1.39_P-5.0V_MAIN 14.88,2.18 | CON1.36_P-5.0V_MAIN 16.38,2.16 | CON1.37_P-5.0V_MAIN 15.88,2.44 v16.27,2.05
  Bottom 0.406: 16.38,2.16 v16.27,2.05 | 14.88,2.18 v14.75,2.05 14.38,2.42
RAW_NOISE
  Top 0.305: R5.1 32.19,31.77 T2.3 arc90 32.19,32.27 32.19,35.58 | R2.2 32.19,35.58 | 32.19,35.58 33.2,34.56 TP2.TP 36.59,34.56 37.52,35.49 C2.1
  Top 0.406: T2.3 31.94,32.1

### Text on the board
Top: rev 03
tNames: GND | NOISY / DIODE | -15V | PWR | 3V3 | NOISE | 5V | 3V3 | GND | GND / pad
tDocu: https://cryptech.is/ / Novena Entropy Source